# Altium schematic sheet Ethernet.SchDoc
size A4
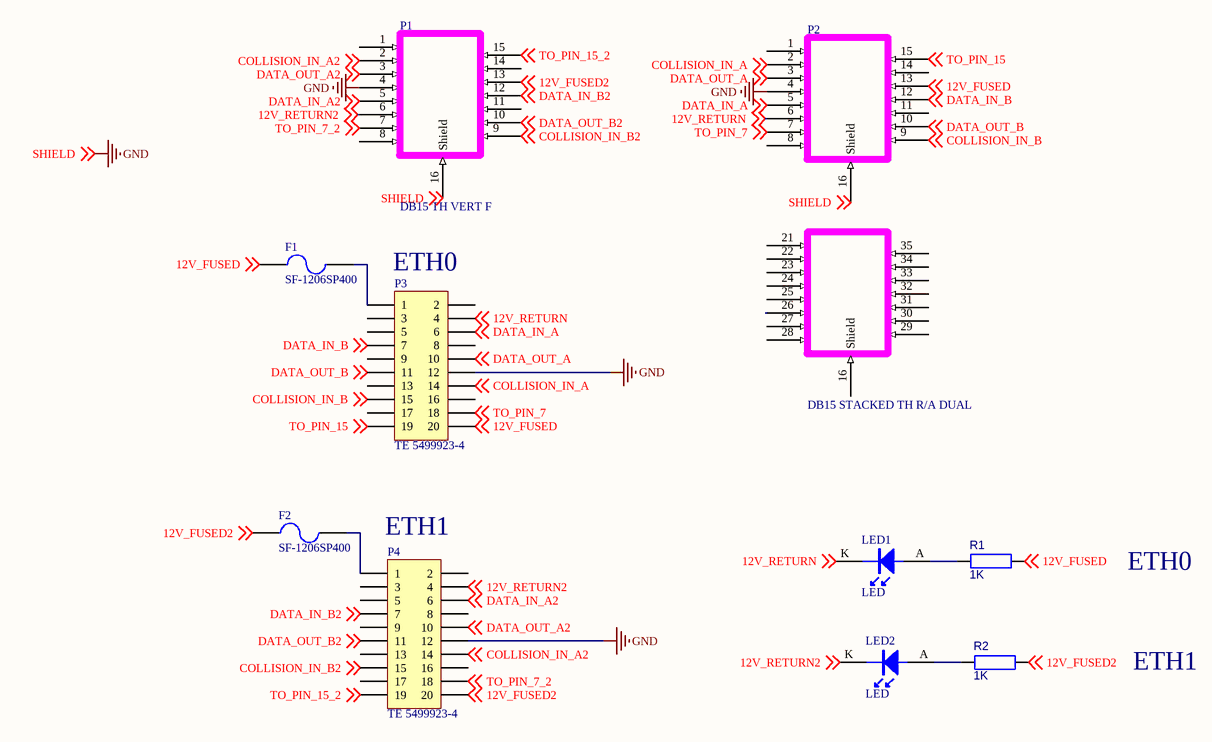
[diagram p0: Ethernet.SchDoc]

## Parts
F1  SF-1206SP400  [F1206SB]
F2  SF-1206SP400  [F1206SB]
LED1  LED  [LTST-C170]  (no BOM)
LED2  LED  [LTST-C170]  (no BOM)
P1  DB15 TH VERT F  [D15S24A4GV00LF]
P2  DB15 STACKED TH R/A DUAL  [189-015-513R571]
P3  TE 5499923-4  [HDR2X10 - Small Pads]
P4  TE 5499923-4  [HDR2X10 - Small Pads]
R1  1K  [RESC2012X70N]  (no BOM)
R2  1K  [RESC2012X70N]  (no BOM)

## Nets
GND: P1.4 P1.16(Shield) P2.4 P2.16(Shield) P3.12 P4.12 ; off-sheet SHIELD  [also labelled SHIELD]
12V_FUSED: F1.1 P2.13 P3.20 R1.1 ; off-sheet 12V_FUSED
12V_FUSED2: F2.1 P1.13 P4.20 R2.1 ; off-sheet 12V_FUSED2
12V_RETURN: LED1.K P2.6 P3.4 ; off-sheet 12V_RETURN
12V_RETURN2: LED2.K P1.6 P4.4 ; off-sheet 12V_RETURN2
COLLISION_IN_A: P2.2 P3.14 ; off-sheet COLLISION_IN_A
COLLISION_IN_A2: P1.2 P4.14 ; off-sheet COLLISION_IN_A2
COLLISION_IN_B: P2.9 P3.15 ; off-sheet COLLISION_IN_B
COLLISION_IN_B2: P1.9 P4.15 ; off-sheet COLLISION_IN_B2
DATA_IN_A: P2.5 P3.6 ; off-sheet DATA_IN_A
DATA_IN_A2: P1.5 P4.6 ; off-sheet DATA_IN_A2
DATA_IN_B: P2.12 P3.7 ; off-sheet DATA_IN_B
DATA_IN_B2: P1.12 P4.7 ; off-sheet DATA_IN_B2
DATA_OUT_A: P2.3 P3.10 ; off-sheet DATA_OUT_A
DATA_OUT_A2: P1.3 P4.10 ; off-sheet DATA_OUT_A2
DATA_OUT_B: P2.10 P3.11 ; off-sheet DATA_OUT_B
DATA_OUT_B2: P1.10 P4.11 ; off-sheet DATA_OUT_B2
TO_PIN_7: P2.7 P3.18 ; off-sheet TO_PIN_7
TO_PIN_7_2: P1.7 P4.18 ; off-sheet TO_PIN_7_2
TO_PIN_15: P2.15 P3.19 ; off-sheet TO_PIN_15
TO_PIN_15_2: P1.15 P4.19 ; off-sheet TO_PIN_15_2
NetF1_2: F1.2 P3.1
NetF2_2: F2.2 P4.1
NetLED1_A: LED1.A R1.2
NetLED2_A: LED2.A R2.2

Not connected (* = marked no-connect by the designer): P1 1 8 11 14; P2 1 8 11 14 21 22 23 24 25 26 27 28 29 30 31 32 33 34 35; P3 2 3 5 8 9 13 16 17; P4 2 3 5 8 9 13 16 17

## Notes on the sheet
- (near P3) ETH0
- (near P4) ETH1
- ETH0
- ETH1

## Library data of the parts
F1 F2 = Fuse 2: Fuse 4A; P/N: 0ZCJ0075AF2E; Published: 8-Jun-2000; LatestRevisionDate: 17-Jul-2002; LatestRevisionNote: Re-released for DXP Platform.; PackageReference: PIN-W2/E2.8; Publisher: Altium Limited
LED1 LED2 = LED: Value: GREEN 0805 LED; P/N: LTST-C170TGKT
P1 = DB15 TH VERT F: P/N: L77SDAG15SOL2RM5
P3 P4 = Header 10X2: Header, 20-Pin, Dual row; LatestRevisionDate: 17-Jul-2002; LatestRevisionNote: Re-released for DXP Platform.; Publisher: Altium Limited; P/N: 5499923-4
R1 R2 = RES2: RESISTOR; P/N: CRCW08051K00FKEAC; Value: 1K
P2 = DB15 STACKED TH R/A DUAL: P/N: 189-015-513R571